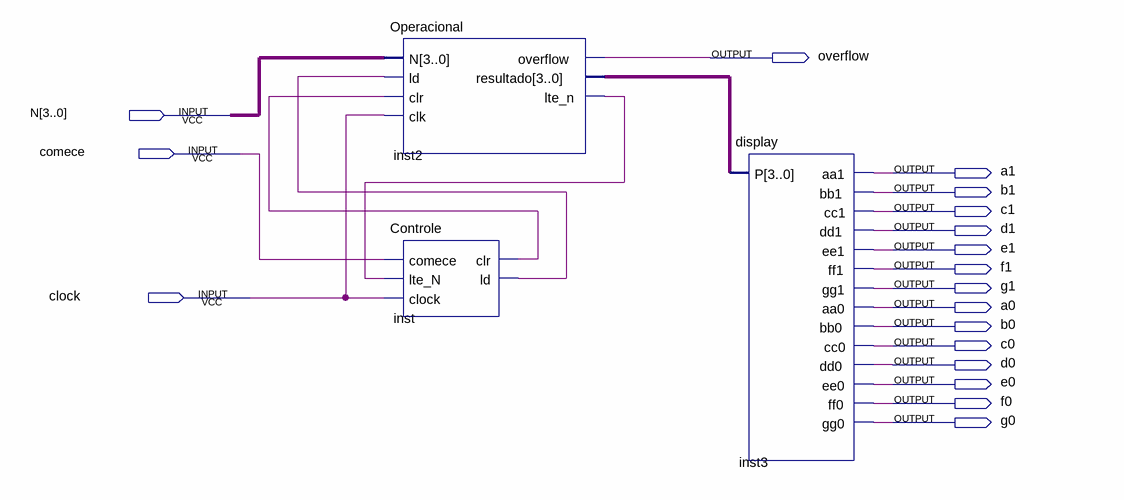
[diagram p0: schematic sheet]
// Quartus schematic Somatorio.bdf as structural Verilog: 3 symbols, 18 pins
module Somatorio (
  input  [3:0] N,
  input  comece,
  input  clock,
  output overflow,
  output a1,
  output b1,
  output c1,
  output d1,
  output e1,
  output f1,
  output g1,
  output a0,
  output b0,
  output c0,
  output d0,
  output e0,
  output f0,
  output g0
);

  wire inst2_lte_n, inst_clr, inst_ld;
  wire [3:0] inst2_resultado;

  Operacional inst2 (
    .N(N), .ld(inst_ld), .clr(inst_clr), .clk(clock), .overflow(overflow), .resultado(inst2_resultado),
    .lte_n(inst2_lte_n));
  Controle inst (.comece(comece), .lte_N(inst2_lte_n), .clock(clock), .clr(inst_clr), .ld(inst_ld));
  display inst3 (
    .P(inst2_resultado), .aa1(a1), .bb1(b1), .cc1(c1), .dd1(d1), .ee1(e1), .ff1(f1), .gg1(g1), .aa0(a0),
    .bb0(b0), .cc0(c0), .dd0(d0), .ee0(e0), .ff0(f0), .gg0(g0));
endmodule
